# Altium schematic sheet OSD.SchDoc
size A4; SheetNumber: 7; SheetTotal: 11
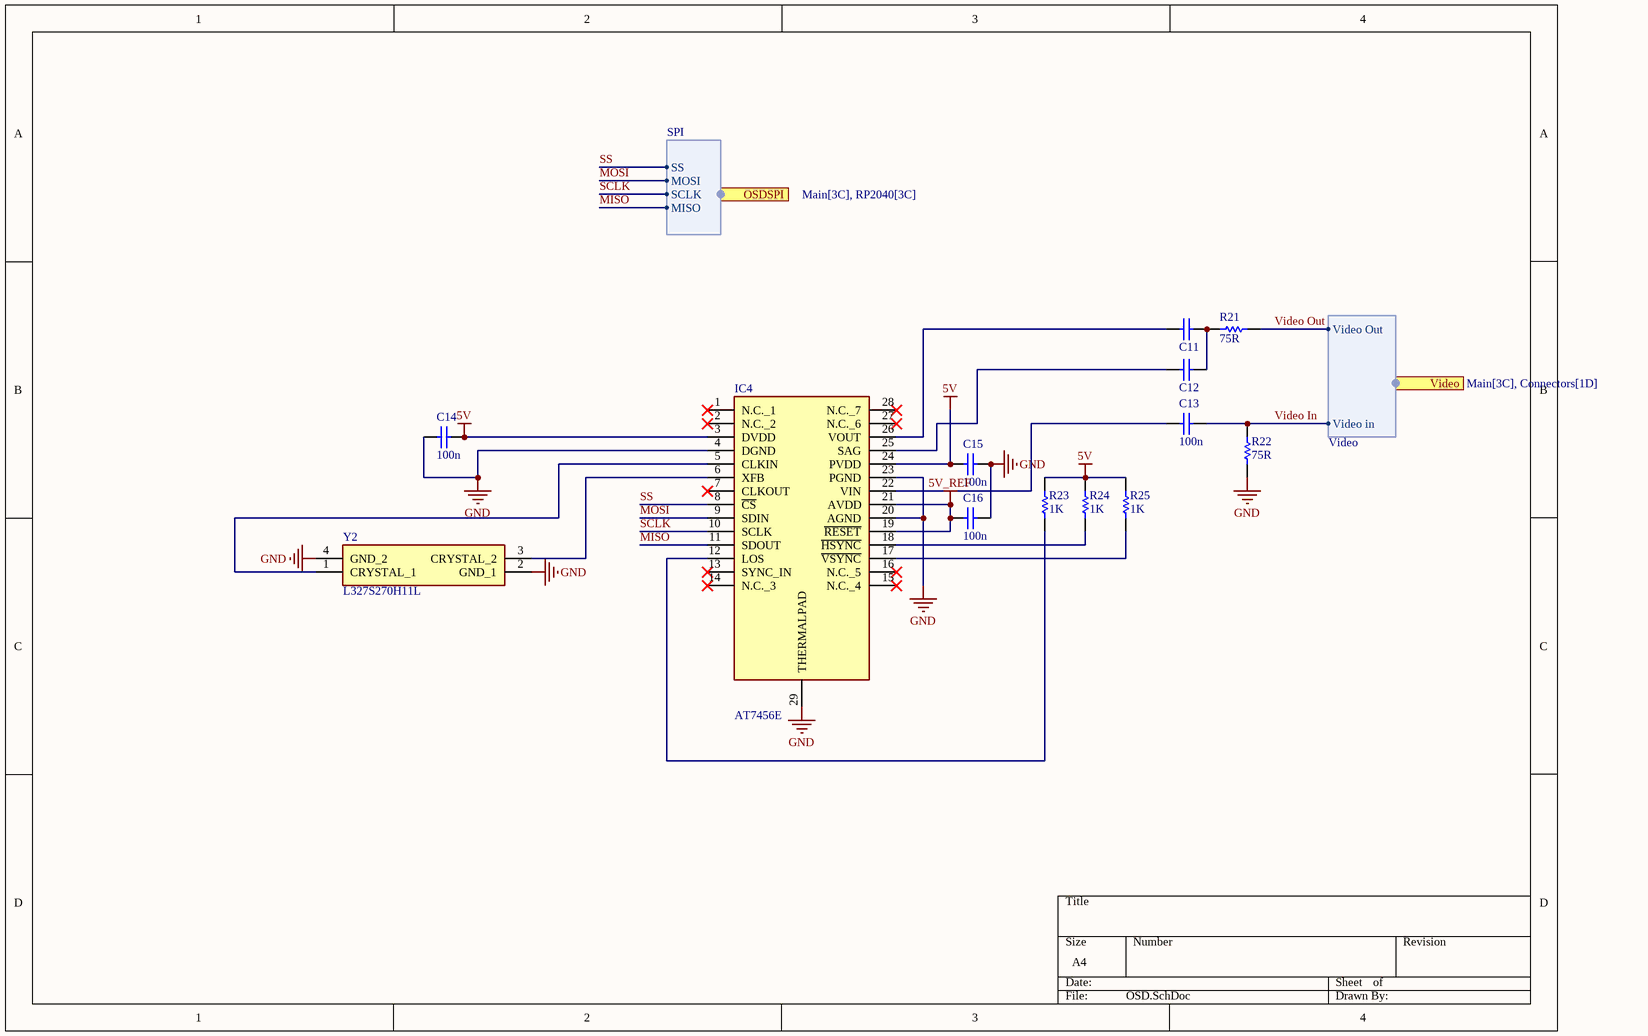
[diagram p0: OSD.SchDoc]

## Parts
C11  10µF  [WCAP-CSGP_0603_L1.6W0.8H0.8_Reflow]  (value not drawn)
C12  10µF  [WCAP-CSGP_0603_L1.6W0.8H0.8_Reflow]  (value not drawn)
C13  100n  [CAPC0603(1608)55_N]
C14  100n  [CAPC0603(1608)55_N]
C15  100n  [CAPC0603(1608)55_N]
C16  100n  [CAPC0603(1608)55_N]
IC4  AT7456E  [SOP65P640X120-29N]
R21  75R  [RESC0603(1608)_N]
R22  75R  [RESC0603(1608)_N]
R23  1K  [RESC0603(1608)_N]
R24  1K  [RESC0603(1608)_N]
R25  1K  [RESC0603(1608)_N]
Y2  L327S270H11L  [SMD3225_4P12288MHZ12PF10PPM4085]

## Ports
OSDSPI (harness SPI, see Main[3C], RP2040[3C]), Video (harness Video, see Main[3C], Connectors[1D])

## Harnesses
SPI: SS, MOSI, SCLK, MISO
Video: Video Out, Video in

## Nets
5V: C14.2 C15.1 IC4.3(DVDD) IC4.24(PVDD) R23.2 R24.2 R25.2
5V_REF: C16.1 IC4.19(~{RESET}) IC4.21(AVDD)
GND: C14.1 C15.2 C16.2 IC4.4(DGND) IC4.20(AGND) IC4.23(PGND) IC4.29(THERMALPAD) R22.1 Y2.2(GND_1) Y2.4(GND_2)
MISO: IC4.11(SDOUT) ; port OSDSPI.MISO
MOSI: IC4.9(SDIN) ; port OSDSPI.MOSI
SCLK: IC4.10(SCLK) ; port OSDSPI.SCLK
SS: IC4.8(~{CS}) ; port OSDSPI.SS
Video In: C13.2 R22.2 ; port Video.Video in
Video Out: R21.1 ; port Video.Video Out
NetC11_1: C11.1 IC4.26(VOUT)
NetC11_2: C11.2 C12.2 R21.2
NetC12_1: C12.1 IC4.25(SAG)
NetC13_1: C13.1 IC4.22(VIN)
NetIC4_5: IC4.5(CLKIN) Y2.1(CRYSTAL_1)
NetIC4_6: IC4.6(XFB) Y2.3(CRYSTAL_2)
NetIC4_12: IC4.12(LOS) R23.1
NetIC4_17: IC4.17(~{VSYNC}) R25.1
NetIC4_18: IC4.18(~{HSYNC}) R24.1

Not connected (* = marked no-connect by the designer): IC4 1(N.C._1)* 2(N.C._2)* 7(CLKOUT)* 13(SYNC_IN)* 14(N.C._3)* 15(N.C._4)* 16(N.C._5)* 27(N.C._6)* 28(N.C._7)*

## Library data of the parts
C11 C12 = 885012106031: WCAP-CSGP Multilayer Ceramic Chip Capacitor, General Purpose, size 0603, X5R, 10µF, 25VDC; Manufacturer: Wurth Elektronik; Case/Size Code: 0603; Capacitance Tolerance: +/20%; Dissipation Factor: 20%; Insulation Resistance: 0.01GΩ; Rated Voltage (DC): 25V; Technical Reference: X5R0603106M025DFCT10000; ComponentLink1Description: Website Link; ComponentLink1URL: https://www.we-online.com/redexpert/article/885012106031?ad; ComponentLink2Description: Datasheet Link; ComponentLink2URL: https://www.we-online.com/redexpert/spec/885012106031?ad; Manufacturer Part Number: 885012106031; Category: Multilayer Ceramic Chip Capacitors; Match Code: WCAP-CSGP; Mount: Surface Mount; Operating Temperature Max: 85°C; Operating Temperature Min: -55°C; Packaging: Tape and Reel; Length: 1.6mm; Width: 0.8mm; Height: 0.8mm; Capacitance: 10µF; Ceramic Type: X5R
C13-C16 = Cap 100n: Keramikvielschichtkondensator, SMD, Baureihe MC, ± 20%; Manufacturer: Multicomp; OC_FARNELL: 1759038; Value: 100n; PackageReference: 0603
IC4 = AT7456E: Integrated Circuit; Manufacturer_Name: ICOF; Datasheet Link: https://datasheet.lcsc.com/szlcsc/ZHONGKEWEI-AT7456E_C82351.pdf; Height: 1.2mm; Manufacturer_Part_Number: AT7456E
R21 R22 = Res 750R: Chipwiderstand, SMD, Baureihe MC, 1%; Manufacturer: Multicomp; Value: 750R; PackageReference: 0603; OC_FARNELL: 9331506
R23-R25 = Res 1K: Chipwiderstand, SMD, Baureihe MC, 1%; Manufacturer: Multicomp; PackageReference: 0603; Value: 1K; OC_FARNELL: 9330380
Y2 = SMD-3225_4P_12.288MHZ_12PF_10PPM_-40~+85: Crystal or Oscillator; Manufacturer_Name: TAE(Zhejiang Abel Elec); Manufacturer_Part_Number: SMD-3225_4P 12.288MHZ 12PF 10PPM -40~+85¡æ; Datasheet Link: https://datasheet.lcsc.com/szlcsc/1901241506_Zhejiang-Abel-Elec-SMD-3225-4P-12-288MHZ-12PF-10PPM-40-85_C362472.pdf; Height: 0.8mm